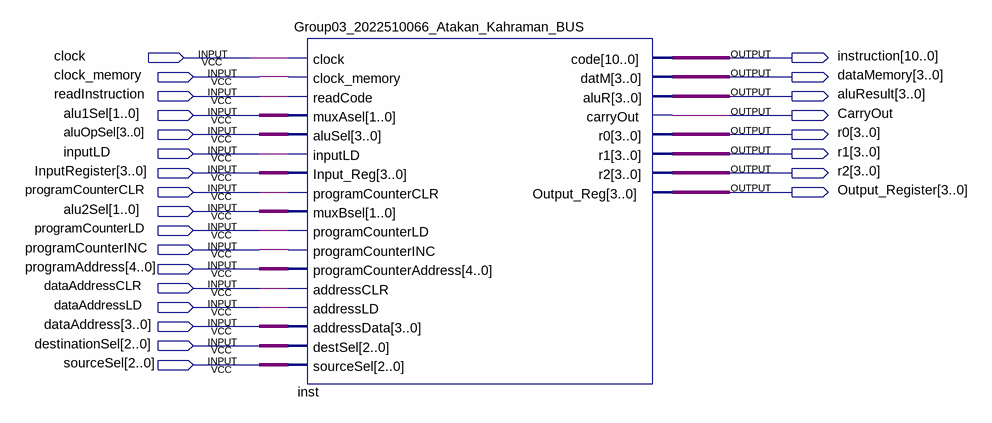
[diagram p0: schematic sheet]
// Quartus schematic Common_Bus_System_2022510066_Group03.bdf as structural Verilog: 1 symbols, 25 pins
module Common_Bus_System_2022510066_Group03 (
  input  clock,
  input  clock_memory,
  input  readInstruction,
  input  [1:0] alu1Sel,
  input  [3:0] aluOpSel,
  input  inputLD,
  input  [3:0] InputRegister,
  input  programCounterCLR,
  input  [1:0] alu2Sel,
  input  programCounterLD,
  input  programCounterINC,
  input  [4:0] programAddress,
  input  dataAddressCLR,
  input  dataAddressLD,
  input  [3:0] dataAddress,
  input  [2:0] destinationSel,
  input  [2:0] sourceSel,
  output [10:0] instruction,
  output [3:0] dataMemory,
  output [3:0] aluResult,
  output CarryOut,
  output [3:0] r0,
  output [3:0] r1,
  output [3:0] r2,
  output [3:0] Output_Register
);

  Group03_2022510066_Atakan_Kahraman_BUS inst (
    .clock(clock), .clock_memory(clock_memory), .readCode(readInstruction), .muxAsel(alu1Sel),
    .aluSel(aluOpSel), .inputLD(inputLD), .Input_Reg(InputRegister), .programCounterCLR(programCounterCLR),
    .muxBsel(alu2Sel), .programCounterLD(programCounterLD), .programCounterINC(programCounterINC),
    .programCounterAddress(programAddress), .addressCLR(dataAddressCLR), .addressLD(dataAddressLD),
    .addressData(dataAddress), .destSel(destinationSel), .sourceSel(sourceSel), .code(instruction),
    .datM(dataMemory), .aluR(aluResult), .carryOut(CarryOut), .r0(r0), .r1(r1), .r2(r2),
    .Output_Reg(Output_Register));
endmodule
